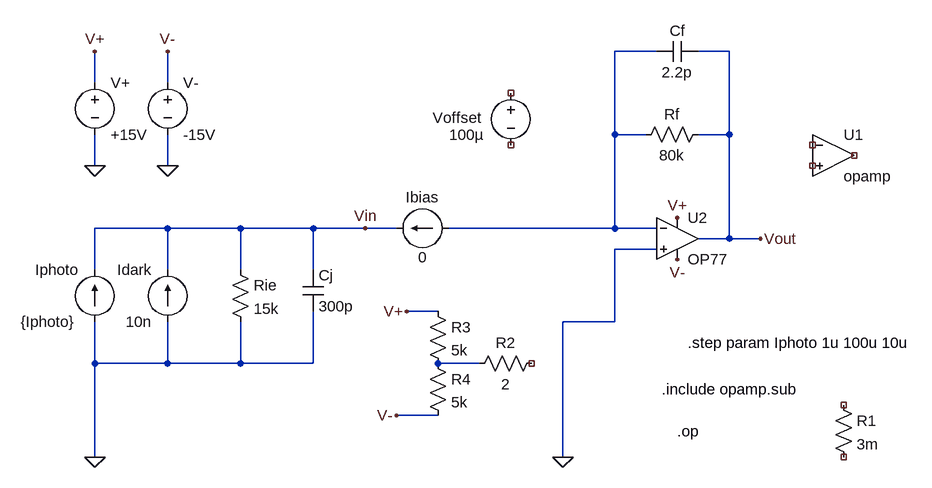
[diagram p0: schematic preamp.asc]
preamp.asc, the LTspice schematic file:
Version 4
SHEET 1 1188 740
WIRE 784 80 720 80
WIRE 896 80 848 80
WIRE -80 128 -80 80
WIRE 32 128 32 80
WIRE 720 208 720 80
WIRE 768 208 720 208
WIRE 896 208 896 80
WIRE 896 208 848 208
WIRE -80 256 -80 208
WIRE 32 256 32 208
WIRE 32 352 -80 352
WIRE 144 352 32 352
WIRE 256 352 144 352
WIRE 336 352 256 352
WIRE 384 352 336 352
WIRE 720 352 720 208
WIRE 720 352 464 352
WIRE 784 352 720 352
WIRE 896 368 896 208
WIRE 896 368 848 368
WIRE 944 368 896 368
WIRE 784 384 720 384
WIRE -80 416 -80 352
WIRE 32 416 32 352
WIRE 144 416 144 352
WIRE 256 416 256 352
WIRE 448 480 400 480
WIRE 720 496 720 384
WIRE 720 496 640 496
WIRE -80 560 -80 496
WIRE 32 560 32 496
WIRE 32 560 -80 560
WIRE 144 560 144 496
WIRE 144 560 32 560
WIRE 256 560 256 480
WIRE 256 560 144 560
WIRE 512 560 448 560
WIRE 448 640 384 640
WIRE -80 704 -80 560
WIRE 640 704 640 496
FLAG -80 256 0
FLAG 32 256 0
FLAG 32 80 V-
FLAG -80 80 V+
FLAG -80 704 0
FLAG 640 704 0
FLAG 944 368 Vout
FLAG 400 480 V+
FLAG 384 640 V-
FLAG 336 352 Vin
FLAG 816 336 V+
FLAG 816 400 V-
SYMBOL voltage -80 112 R0
SYMATTR InstName V+
SYMATTR Value +15V
SYMBOL voltage 32 112 R0
SYMATTR InstName V-
SYMATTR Value -15V
SYMBOL current -80 496 R180
WINDOW 0 24 80 Left 2
WINDOW 3 30 0 Left 2
SYMATTR InstName Iphoto
SYMATTR Value {Iphoto}
SYMATTR Value2 AC 100u
SYMBOL current 32 496 R180
WINDOW 0 24 80 Left 2
WINDOW 3 24 0 Left 2
SYMATTR InstName Idark
SYMATTR Value 10n
SYMBOL res 128 400 R0
SYMATTR InstName Rie
SYMATTR Value 15k
SYMBOL cap 240 416 R0
SYMATTR InstName Cj
SYMATTR Value 300p
SYMBOL cap 848 64 R90
WINDOW 0 0 32 VBottom 2
WINDOW 3 32 32 VTop 2
SYMATTR InstName Cf
SYMATTR Value 2.2p
SYMBOL res 864 192 R90
WINDOW 0 0 56 VBottom 2
WINDOW 3 32 56 VTop 2
SYMATTR InstName Rf
SYMATTR Value 80k
SYMBOL current 464 352 R90
WINDOW 0 -32 40 VBottom 2
WINDOW 3 60 40 VBottom 2
SYMATTR InstName Ibias
SYMATTR Value 0
SYMBOL Opamps/opamp 1056 176 R0
SYMATTR InstName U1
SYMBOL voltage 560 128 R0
WINDOW 0 -120 54 Left 2
WINDOW 3 -95 80 Left 2
SYMATTR InstName Voffset
SYMATTR Value 100µ
SYMBOL res 1056 608 R0
SYMATTR InstName R1
SYMATTR Value 3m
SYMBOL res 608 544 R90
WINDOW 0 0 56 VBottom 2
WINDOW 3 32 56 VTop 2
SYMATTR InstName R2
SYMATTR Value 2
SYMBOL res 432 464 R0
SYMATTR InstName R3
SYMATTR Value 5k
SYMBOL res 432 544 R0
SYMATTR InstName R4
SYMATTR Value 5k
SYMBOL Opamps/OP77 816 304 R0
SYMATTR InstName U2
TEXT 832 528 Left 2 !.step param Iphoto 1u 100u 10u
TEXT 792 600 Left 2 !.include opamp.sub
TEXT 816 664 Left 2 !.op

The netlist it stands for:
* preamp.asc
V+ V+ 0 +15V
V- V- 0 -15V
Iphoto 0 Vin {Iphoto} AC 100u
Idark 0 Vin 10n
Rie Vin 0 15k
Cj Vin 0 300p
Cf Vout N001 2.2p
Rf Vout N001 80k
Ibias N001 Vin 0
XU1 NC_01 NC_02 NC_03 opamp Aol=100K GBW=10Meg  ; pins invin noninvin out
Voffset NC_04 NC_05 100µ
R1 NC_06 NC_07 3m
R2 NC_08 N002 2
R3 V+ N002 5k
R4 N002 V- 5k
XU2 0 N001 V+ V- Vout OP77  ; pins In+ In- V+ V- OUT
.step param Iphoto 1u 100u 10u
.include opamp.sub
.op
.lib ADI.lib
.backanno
.end